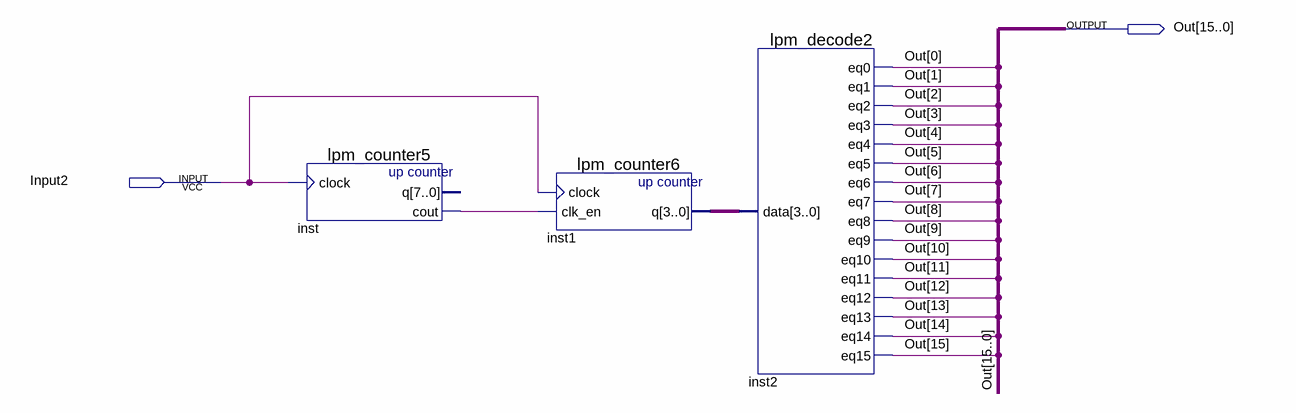
[diagram p0: schematic sheet]
// Quartus schematic Task2.bdf as structural Verilog: 3 symbols, 2 pins
module Task2 (
  input  Input2,
  output [15:0] Out
);

  wire inst_cout;
  wire [3:0] inst1_q;

  lpm_counter5 inst (.clock(Input2), .cout(inst_cout));  // open: q
  lpm_counter6 inst1 (.clock(Input2), .clk_en(inst_cout), .q(inst1_q));
  lpm_decode2 inst2 (
    .data(inst1_q), .eq0(Out[0]), .eq1(Out[1]), .eq2(Out[2]), .eq3(Out[3]), .eq4(Out[4]), .eq5(Out[5]),
    .eq6(Out[6]), .eq7(Out[7]), .eq8(Out[8]), .eq9(Out[9]), .eq10(Out[10]), .eq11(Out[11]), .eq12(Out[12]),
    .eq13(Out[13]), .eq14(Out[14]), .eq15(Out[15]));
endmodule
